# Altium schematic sheet MOTORES.SchDoc
size A4
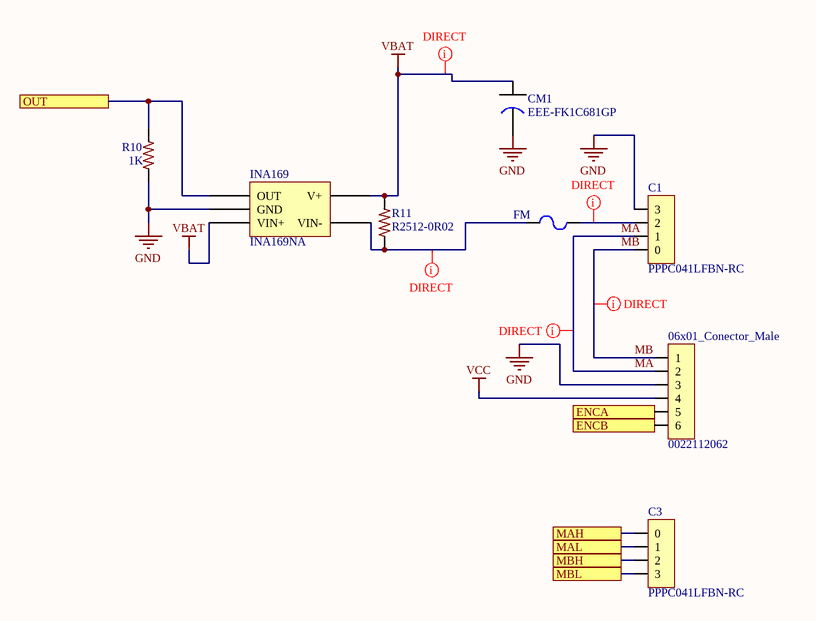
[diagram p0: MOTORES.SchDoc]

## Parts
06x01_Conector_Male  0022112062  [06x01_Conector_Male]
C1  PPPC041LFBN-RC  [04x01_Conector_Female]
C3  PPPC041LFBN-RC  [04x01_Conector_Female]
CM1  EEE-FK1C681GP  [EEE-FK1C681GP]
FM  MF-MSMF250/16X  [RESC4632X16N]  (value not drawn)
INA169  INA169NA  [SOT95P280X125-5N]
R10  1K  [0402-RES-HD]
R11  R2512-0R02  [2512-RES-HD]

## Ports
ENCA, ENCB, MAH, MAL, MBH, MBL, OUT

## Nets
GND: 06x01_Conector_Male.3 C1.3 CM1.2 INA169.2(GND) R10.1
VBAT: CM1.1 INA169.3(VIN+) INA169.4(V+) R11.2
VCC: 06x01_Conector_Male.4
ENCA: 06x01_Conector_Male.5 ; port ENCA
ENCB: 06x01_Conector_Male.6 ; port ENCB
MA: 06x01_Conector_Male.2 C1.1
MAH: C3.0 ; port MAH
MAL: C3.1 ; port MAL
MB: 06x01_Conector_Male.1 C1.0
MBH: C3.2 ; port MBH
MBL: C3.3 ; port MBL
OUT: INA169.1(OUT) R10.2 ; port OUT
NetC1_2: C1.2 FM.1
NetFM_2: FM.2 INA169.5(VIN-) R11.1

## Layout directives
net class DIRECT: MA, MB, NetC1_2, NetFM_2, VBAT

## Library data of the parts
06x01_Conector_Male = 06x01_Conector_Male: CONN HEADER 6POS .100 VERT GOLD
C1 C3 = 04x01_Conector_Female-SCH: 4 Position Header Connector 0.100" (2.54mm) Through Hole Gold
CM1 = CAP AL 680UF/16V: Aluminum Electrolytic Capacitors - SMD Al Lytic Cap SMT FK Series 105C
FM = MF-MSMF250/16X-01.A.1: PTC RESETTABLE .30A 30V 1812
INA169 = INA169NA-01.A.1: IC CURRENT MONITOR 0.5% SOT23-5
R10 = R0402-1K-A.9: RES 1K OHM 1/10W 1% 0402 SMD; Part No: ERJ-2RKF1001X; Cod EMS: 05.280.029.527; Family Description: RESISTOR FILME ESPESSO 10R-1M / 1/10W / 1% / 0402. P/N: ERJ-2RKF....X – PANASONIC ELECTRONIC COMPONENTS.; Value: 1K; Family: ERJ-2RKF....X
R11 = R2512-0R02-4: RES .02 OHM 2W 1% 2512 SMD; Part No: WSL2512R0200FEA18; Cod EMS: 05.280.029.529; Value: 0.02; Family Description: RESISTOR SENTIDO DE CORRENTE 0,010R-0,040R/ 2W / 1% / 2512 P/N: WSL2512.....FEA18 – VISHAY DALE.; Family: WSL2512.....FEA18